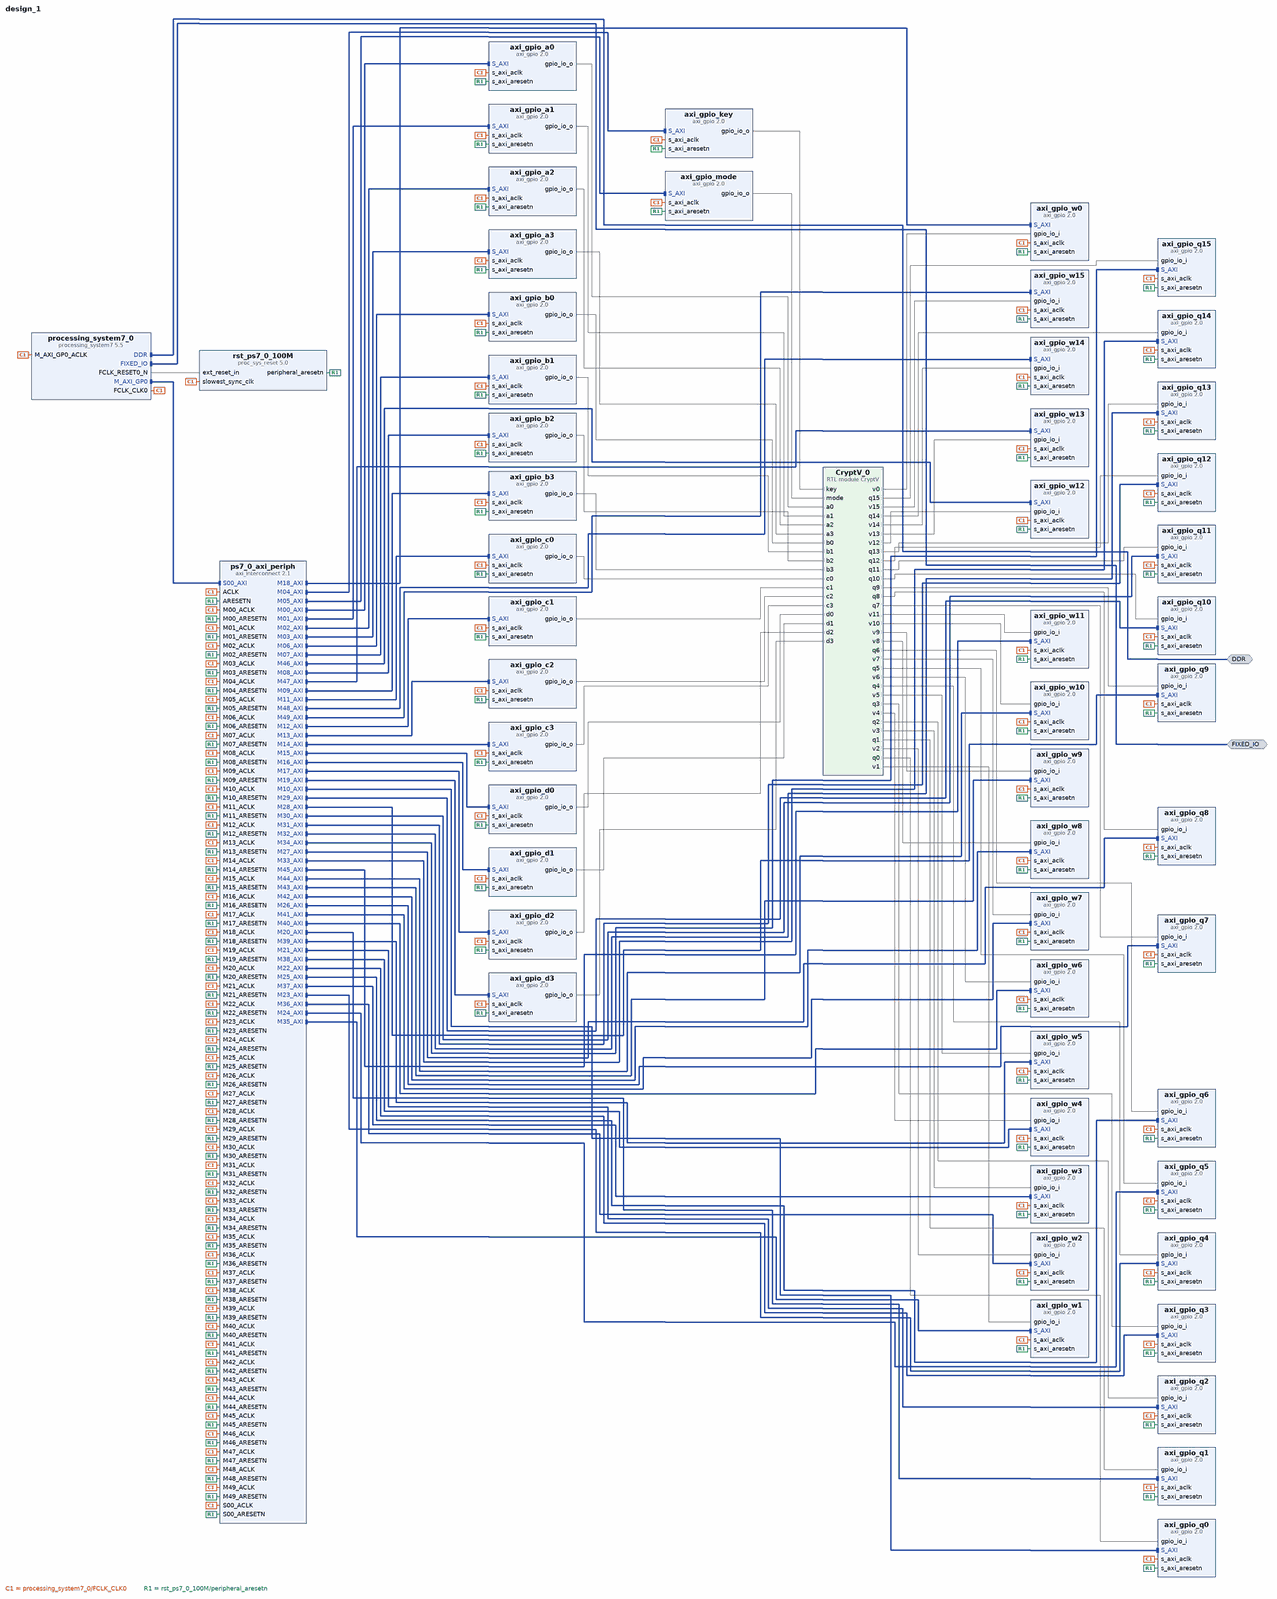
[diagram p0: block diagram of the top level, whole]
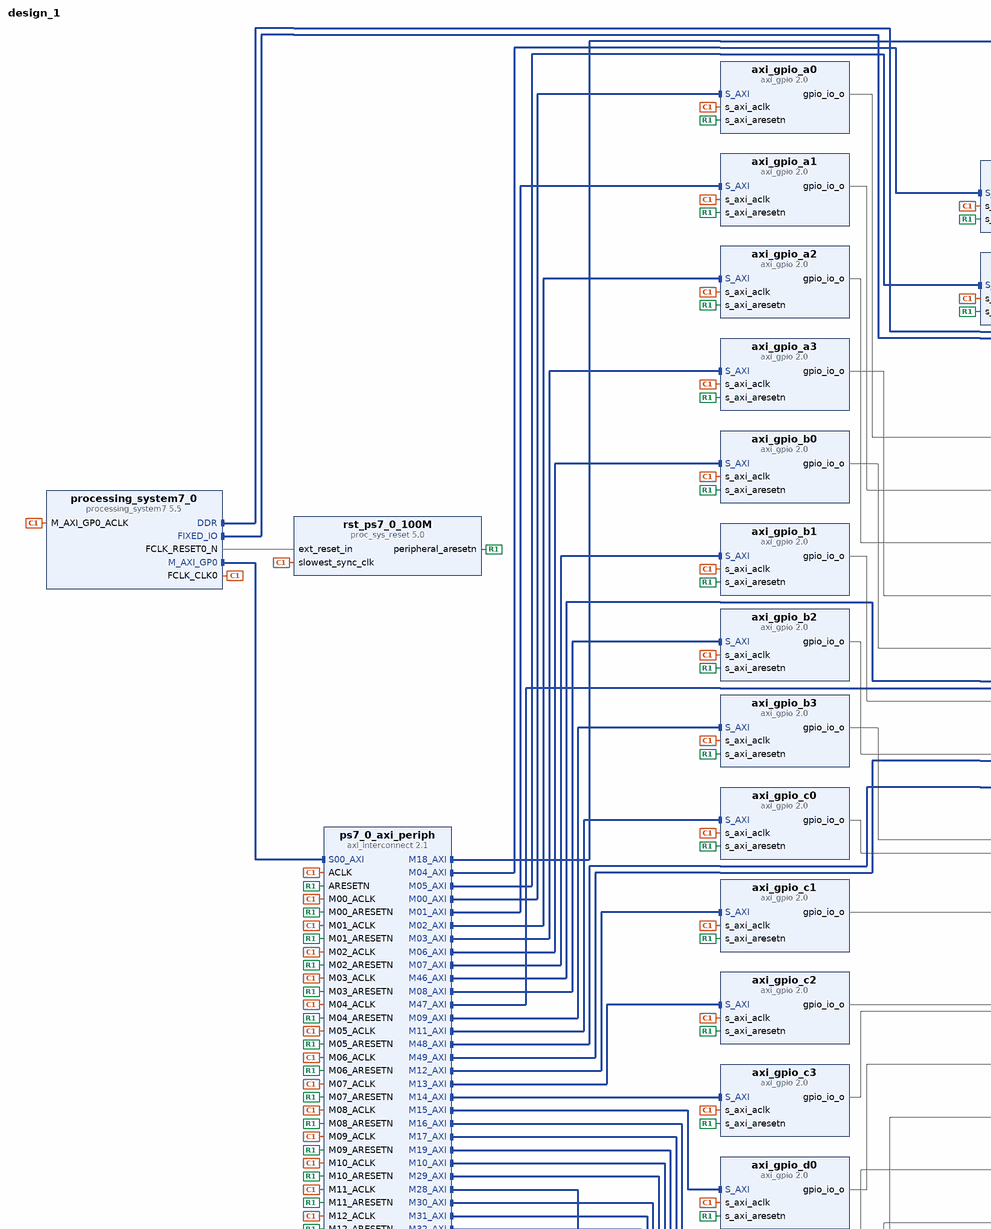
[diagram p1: block diagram of the top level, upper left part]
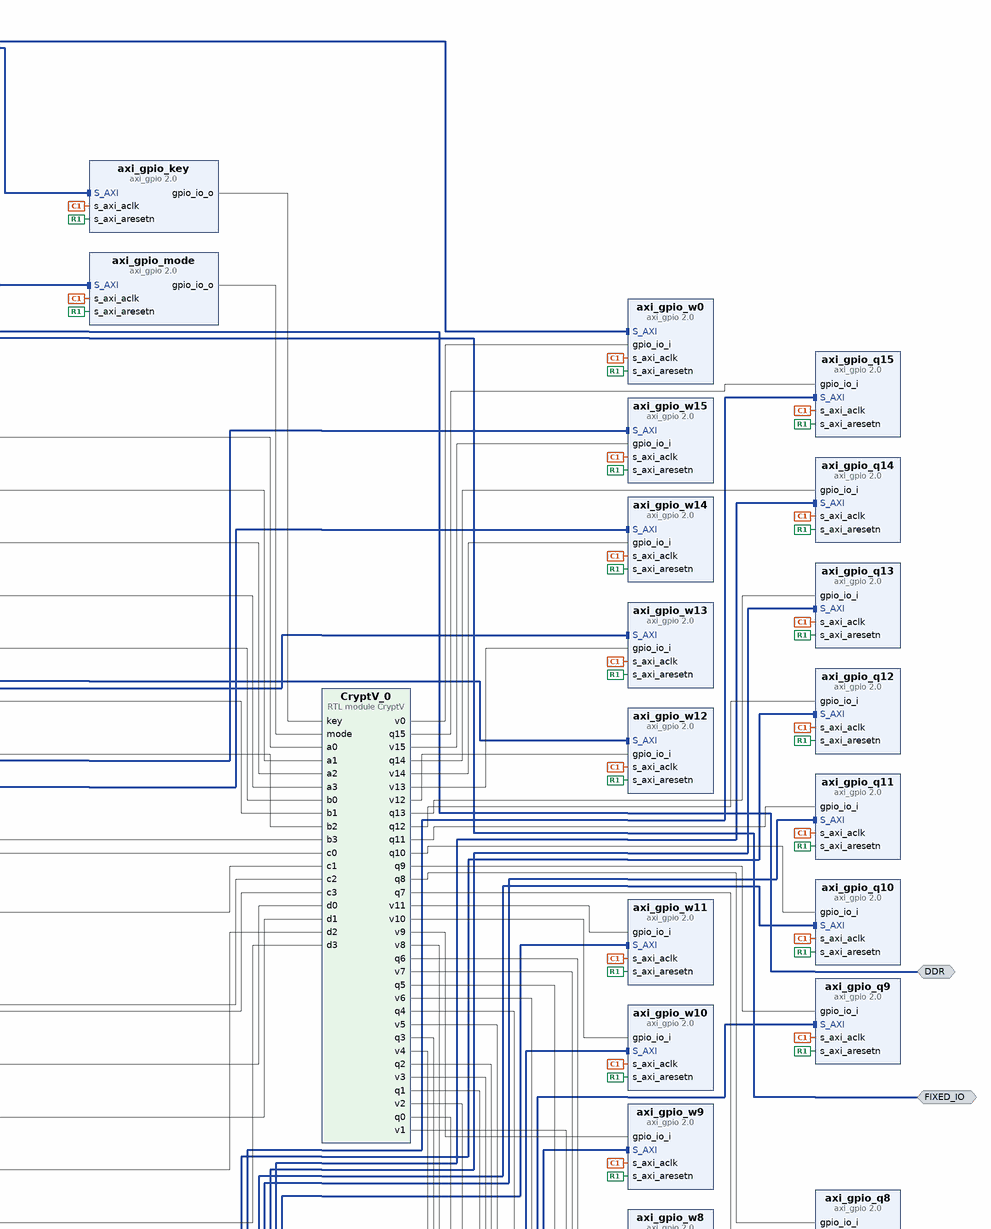
[diagram p2: block diagram of the top level, upper right part]
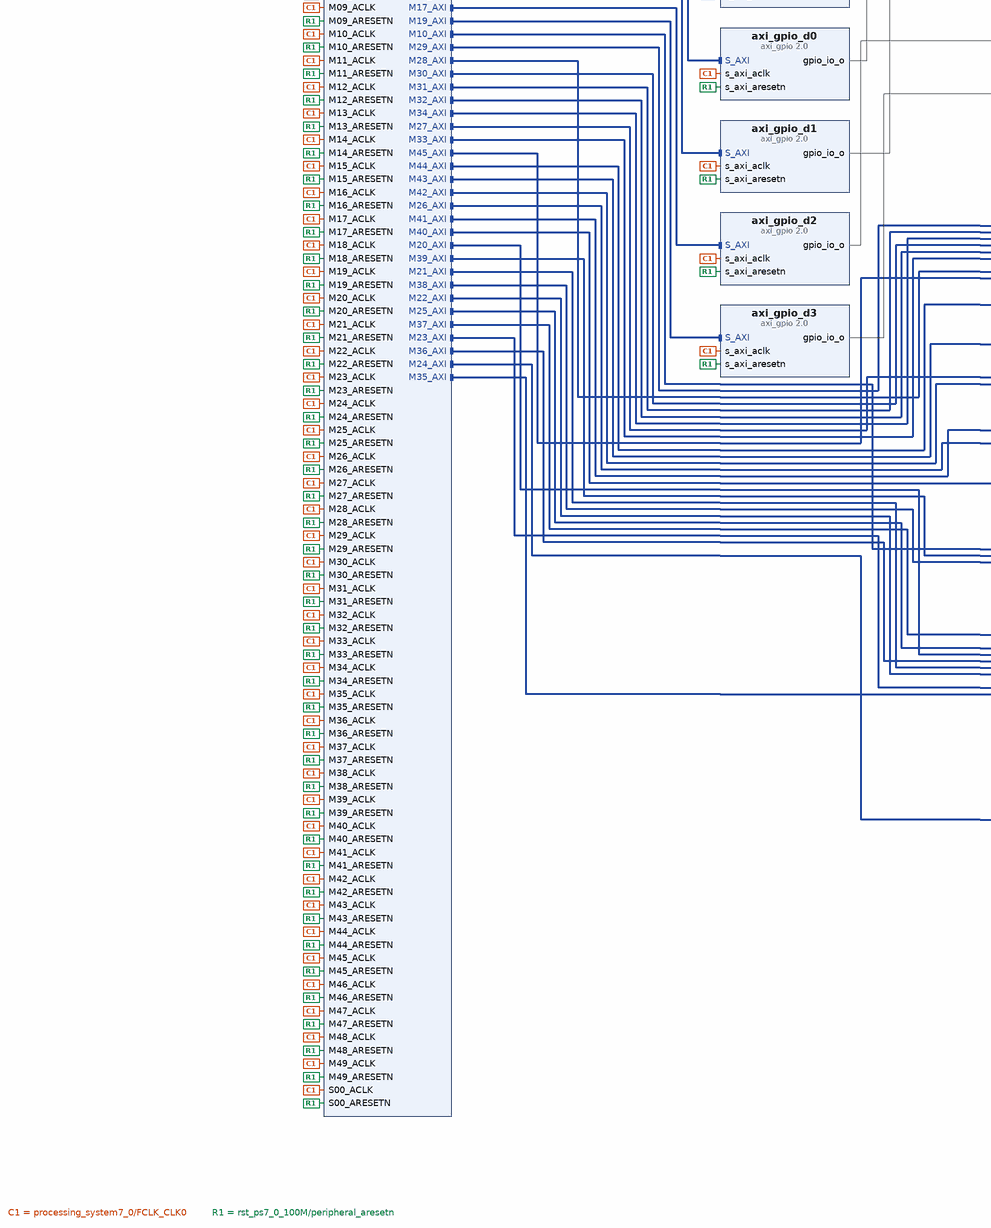
[diagram p3: block diagram of the top level, lower left part]
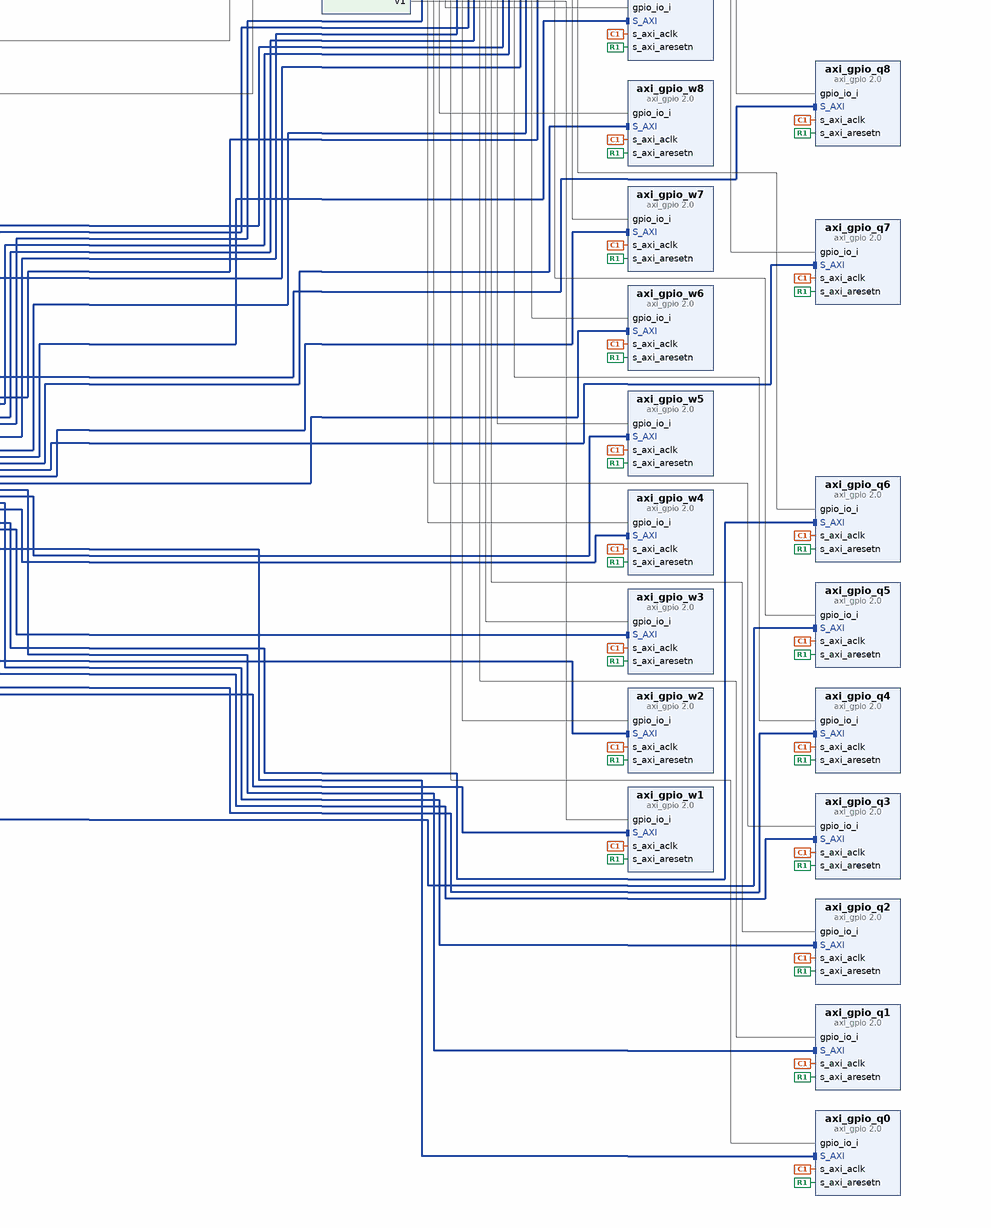
[diagram p4: block diagram of the top level, lower right part]
# Vivado block design design_1, xc7z020clg400-1, Vivado 2022.1
create_bd_design design_1

create_bd_intf_port -mode Master -vlnv xilinx.com:interface:ddrx_rtl:1.0 DDR
create_bd_intf_port -mode Master -vlnv xilinx.com:display_processing_system7:fixedio_rtl:1.0 FIXED_IO

create_bd_cell -type ip -vlnv xilinx.com:ip:processing_system7:5.5 processing_system7_0
set_property -dict [list \
  CONFIG.PCW_APU_PERIPHERAL_FREQMHZ 650 \
  CONFIG.PCW_CRYSTAL_PERIPHERAL_FREQMHZ 50 \
  CONFIG.PCW_ENET0_ENET0_IO {MIO 16 .. 27} \
  CONFIG.PCW_ENET0_GRP_MDIO_ENABLE 1 \
  CONFIG.PCW_ENET0_GRP_MDIO_IO {MIO 52 .. 53} \
  CONFIG.PCW_ENET0_PERIPHERAL_ENABLE 1 \
  CONFIG.PCW_ENET0_RESET_ENABLE 1 \
  CONFIG.PCW_ENET0_RESET_IO {MIO 9} \
  CONFIG.PCW_ENET_RESET_ENABLE 1 \
  CONFIG.PCW_ENET_RESET_SELECT {Share reset pin} \
  CONFIG.PCW_FPGA0_PERIPHERAL_FREQMHZ 100 \
  CONFIG.PCW_FPGA1_PERIPHERAL_FREQMHZ 50 \
  CONFIG.PCW_GPIO_MIO_GPIO_ENABLE 1 \
  CONFIG.PCW_GPIO_MIO_GPIO_IO MIO \
  CONFIG.PCW_I2C_RESET_ENABLE 1 \
  CONFIG.PCW_M_AXI_GP0_FREQMHZ 10 \
  CONFIG.PCW_PERIPHERAL_BOARD_PRESET None \
  CONFIG.PCW_PRESET_BANK1_VOLTAGE {LVCMOS 1.8V} \
  CONFIG.PCW_QSPI_GRP_FBCLK_ENABLE 1 \
  CONFIG.PCW_QSPI_GRP_FBCLK_IO {MIO 8} \
  CONFIG.PCW_QSPI_GRP_SINGLE_SS_ENABLE 1 \
  CONFIG.PCW_QSPI_GRP_SINGLE_SS_IO {MIO 1 .. 6} \
  CONFIG.PCW_QSPI_PERIPHERAL_ENABLE 1 \
  CONFIG.PCW_QSPI_QSPI_IO {MIO 1 .. 6} \
  CONFIG.PCW_SD0_GRP_CD_ENABLE 1 \
  CONFIG.PCW_SD0_GRP_CD_IO {MIO 47} \
  CONFIG.PCW_SD0_GRP_WP_ENABLE 0 \
  CONFIG.PCW_SD0_PERIPHERAL_ENABLE 1 \
  CONFIG.PCW_SD0_SD0_IO {MIO 40 .. 45} \
  CONFIG.PCW_SDIO_PERIPHERAL_FREQMHZ 50 \
  CONFIG.PCW_SINGLE_QSPI_DATA_MODE x4 \
  CONFIG.PCW_UART0_PERIPHERAL_ENABLE 1 \
  CONFIG.PCW_UART0_UART0_IO {MIO 14 .. 15} \
  CONFIG.PCW_UART1_PERIPHERAL_ENABLE 0 \
  CONFIG.PCW_UART_PERIPHERAL_FREQMHZ 100 \
  CONFIG.PCW_UIPARAM_DDR_BUS_WIDTH {16 Bit} \
  CONFIG.PCW_UIPARAM_DDR_FREQ_MHZ 525 \
  CONFIG.PCW_UIPARAM_DDR_PARTNO {MT41J256M16 RE-125} \
  CONFIG.PCW_USB0_PERIPHERAL_ENABLE 1 \
  CONFIG.PCW_USB0_RESET_ENABLE 1 \
  CONFIG.PCW_USB0_RESET_IO {MIO 46} \
  CONFIG.PCW_USB0_USB0_IO {MIO 28 .. 39} \
  CONFIG.PCW_USB_RESET_ENABLE 1 \
  CONFIG.PCW_USB_RESET_SELECT {Share reset pin} \
] [get_bd_cells processing_system7_0]
# 481 more settings of processing_system7_0 are not shown: defaults, MIO pin electricals, DDR timing, and values the tool derives
create_bd_cell -type ip -vlnv xilinx.com:ip:axi_gpio:2.0 axi_gpio_key
set_property -dict {CONFIG.C_ALL_OUTPUTS 1 CONFIG.C_GPIO_WIDTH 10} [get_bd_cells axi_gpio_key]
create_bd_cell -type ip -vlnv xilinx.com:ip:axi_gpio:2.0 axi_gpio_mode
set_property -dict {CONFIG.C_ALL_OUTPUTS 1 CONFIG.C_GPIO_WIDTH 1} [get_bd_cells axi_gpio_mode]
create_bd_cell -type ip -vlnv xilinx.com:ip:axi_gpio:2.0 axi_gpio_q0
set_property -dict {CONFIG.C_ALL_INPUTS 1 CONFIG.C_GPIO_WIDTH 8 CONFIG.C_IS_DUAL 0} [get_bd_cells axi_gpio_q0]
create_bd_cell -type ip -vlnv xilinx.com:ip:axi_gpio:2.0 axi_gpio_w0
set_property -dict {CONFIG.C_ALL_INPUTS 1 CONFIG.C_GPIO_WIDTH 8 CONFIG.C_IS_DUAL 0} [get_bd_cells axi_gpio_w0]
create_bd_cell -type ip -vlnv xilinx.com:ip:axi_interconnect:2.1 ps7_0_axi_periph
set_property -dict {CONFIG.NUM_MI 50} [get_bd_cells ps7_0_axi_periph]
create_bd_cell -type ip -vlnv xilinx.com:ip:proc_sys_reset:5.0 rst_ps7_0_100M
create_bd_cell -type module -reference CryptV CryptV_0
create_bd_cell -type ip -vlnv xilinx.com:ip:axi_gpio:2.0 axi_gpio_a0
set_property -dict {CONFIG.C_ALL_OUTPUTS 1 CONFIG.C_GPIO_WIDTH 8 CONFIG.C_IS_DUAL 0} [get_bd_cells axi_gpio_a0]
create_bd_cell -type ip -vlnv xilinx.com:ip:axi_gpio:2.0 axi_gpio_q1
set_property -dict {CONFIG.C_ALL_INPUTS 1 CONFIG.C_GPIO_WIDTH 8 CONFIG.C_IS_DUAL 0} [get_bd_cells axi_gpio_q1]
create_bd_cell -type ip -vlnv xilinx.com:ip:axi_gpio:2.0 axi_gpio_q2
set_property -dict {CONFIG.C_ALL_INPUTS 1 CONFIG.C_GPIO_WIDTH 8 CONFIG.C_IS_DUAL 0} [get_bd_cells axi_gpio_q2]
create_bd_cell -type ip -vlnv xilinx.com:ip:axi_gpio:2.0 axi_gpio_q3
set_property -dict {CONFIG.C_ALL_INPUTS 1 CONFIG.C_GPIO_WIDTH 8 CONFIG.C_IS_DUAL 0} [get_bd_cells axi_gpio_q3]
create_bd_cell -type ip -vlnv xilinx.com:ip:axi_gpio:2.0 axi_gpio_q4
set_property -dict {CONFIG.C_ALL_INPUTS 1 CONFIG.C_GPIO_WIDTH 8 CONFIG.C_IS_DUAL 0} [get_bd_cells axi_gpio_q4]
create_bd_cell -type ip -vlnv xilinx.com:ip:axi_gpio:2.0 axi_gpio_q5
set_property -dict {CONFIG.C_ALL_INPUTS 1 CONFIG.C_GPIO_WIDTH 8 CONFIG.C_IS_DUAL 0} [get_bd_cells axi_gpio_q5]
create_bd_cell -type ip -vlnv xilinx.com:ip:axi_gpio:2.0 axi_gpio_q6
set_property -dict {CONFIG.C_ALL_INPUTS 1 CONFIG.C_GPIO_WIDTH 8 CONFIG.C_IS_DUAL 0} [get_bd_cells axi_gpio_q6]
create_bd_cell -type ip -vlnv xilinx.com:ip:axi_gpio:2.0 axi_gpio_q7
set_property -dict {CONFIG.C_ALL_INPUTS 1 CONFIG.C_GPIO_WIDTH 8 CONFIG.C_IS_DUAL 0} [get_bd_cells axi_gpio_q7]
create_bd_cell -type ip -vlnv xilinx.com:ip:axi_gpio:2.0 axi_gpio_q8
set_property -dict {CONFIG.C_ALL_INPUTS 1 CONFIG.C_GPIO_WIDTH 8 CONFIG.C_IS_DUAL 0} [get_bd_cells axi_gpio_q8]
create_bd_cell -type ip -vlnv xilinx.com:ip:axi_gpio:2.0 axi_gpio_q9
set_property -dict {CONFIG.C_ALL_INPUTS 1 CONFIG.C_GPIO_WIDTH 8 CONFIG.C_IS_DUAL 0} [get_bd_cells axi_gpio_q9]
create_bd_cell -type ip -vlnv xilinx.com:ip:axi_gpio:2.0 axi_gpio_q10
set_property -dict {CONFIG.C_ALL_INPUTS 1 CONFIG.C_GPIO_WIDTH 8 CONFIG.C_IS_DUAL 0} [get_bd_cells axi_gpio_q10]
create_bd_cell -type ip -vlnv xilinx.com:ip:axi_gpio:2.0 axi_gpio_q11
set_property -dict {CONFIG.C_ALL_INPUTS 1 CONFIG.C_GPIO_WIDTH 8 CONFIG.C_IS_DUAL 0} [get_bd_cells axi_gpio_q11]
create_bd_cell -type ip -vlnv xilinx.com:ip:axi_gpio:2.0 axi_gpio_q12
set_property -dict {CONFIG.C_ALL_INPUTS 1 CONFIG.C_GPIO_WIDTH 8 CONFIG.C_IS_DUAL 0} [get_bd_cells axi_gpio_q12]
create_bd_cell -type ip -vlnv xilinx.com:ip:axi_gpio:2.0 axi_gpio_q13
set_property -dict {CONFIG.C_ALL_INPUTS 1 CONFIG.C_GPIO_WIDTH 8 CONFIG.C_IS_DUAL 0} [get_bd_cells axi_gpio_q13]
create_bd_cell -type ip -vlnv xilinx.com:ip:axi_gpio:2.0 axi_gpio_q14
set_property -dict {CONFIG.C_ALL_INPUTS 1 CONFIG.C_GPIO_WIDTH 8 CONFIG.C_IS_DUAL 0} [get_bd_cells axi_gpio_q14]
create_bd_cell -type ip -vlnv xilinx.com:ip:axi_gpio:2.0 axi_gpio_q15
set_property -dict {CONFIG.C_ALL_INPUTS 1 CONFIG.C_GPIO_WIDTH 8 CONFIG.C_IS_DUAL 0} [get_bd_cells axi_gpio_q15]
create_bd_cell -type ip -vlnv xilinx.com:ip:axi_gpio:2.0 axi_gpio_w1
set_property -dict {CONFIG.C_ALL_INPUTS 1 CONFIG.C_GPIO_WIDTH 8 CONFIG.C_IS_DUAL 0} [get_bd_cells axi_gpio_w1]
create_bd_cell -type ip -vlnv xilinx.com:ip:axi_gpio:2.0 axi_gpio_w2
set_property -dict {CONFIG.C_ALL_INPUTS 1 CONFIG.C_GPIO_WIDTH 8 CONFIG.C_IS_DUAL 0} [get_bd_cells axi_gpio_w2]
create_bd_cell -type ip -vlnv xilinx.com:ip:axi_gpio:2.0 axi_gpio_w3
set_property -dict {CONFIG.C_ALL_INPUTS 1 CONFIG.C_GPIO_WIDTH 8 CONFIG.C_IS_DUAL 0} [get_bd_cells axi_gpio_w3]
create_bd_cell -type ip -vlnv xilinx.com:ip:axi_gpio:2.0 axi_gpio_w4
set_property -dict {CONFIG.C_ALL_INPUTS 1 CONFIG.C_GPIO_WIDTH 8 CONFIG.C_IS_DUAL 0} [get_bd_cells axi_gpio_w4]
create_bd_cell -type ip -vlnv xilinx.com:ip:axi_gpio:2.0 axi_gpio_w5
set_property -dict {CONFIG.C_ALL_INPUTS 1 CONFIG.C_GPIO_WIDTH 8 CONFIG.C_IS_DUAL 0} [get_bd_cells axi_gpio_w5]
create_bd_cell -type ip -vlnv xilinx.com:ip:axi_gpio:2.0 axi_gpio_w6
set_property -dict {CONFIG.C_ALL_INPUTS 1 CONFIG.C_GPIO_WIDTH 8 CONFIG.C_IS_DUAL 0} [get_bd_cells axi_gpio_w6]
create_bd_cell -type ip -vlnv xilinx.com:ip:axi_gpio:2.0 axi_gpio_w7
set_property -dict {CONFIG.C_ALL_INPUTS 1 CONFIG.C_GPIO_WIDTH 8 CONFIG.C_IS_DUAL 0} [get_bd_cells axi_gpio_w7]
create_bd_cell -type ip -vlnv xilinx.com:ip:axi_gpio:2.0 axi_gpio_w8
set_property -dict {CONFIG.C_ALL_INPUTS 1 CONFIG.C_GPIO_WIDTH 8 CONFIG.C_IS_DUAL 0} [get_bd_cells axi_gpio_w8]
create_bd_cell -type ip -vlnv xilinx.com:ip:axi_gpio:2.0 axi_gpio_w9
set_property -dict {CONFIG.C_ALL_INPUTS 1 CONFIG.C_GPIO_WIDTH 8 CONFIG.C_IS_DUAL 0} [get_bd_cells axi_gpio_w9]
create_bd_cell -type ip -vlnv xilinx.com:ip:axi_gpio:2.0 axi_gpio_w10
set_property -dict {CONFIG.C_ALL_INPUTS 1 CONFIG.C_GPIO_WIDTH 8 CONFIG.C_IS_DUAL 0} [get_bd_cells axi_gpio_w10]
create_bd_cell -type ip -vlnv xilinx.com:ip:axi_gpio:2.0 axi_gpio_w11
set_property -dict {CONFIG.C_ALL_INPUTS 1 CONFIG.C_GPIO_WIDTH 8 CONFIG.C_IS_DUAL 0} [get_bd_cells axi_gpio_w11]
create_bd_cell -type ip -vlnv xilinx.com:ip:axi_gpio:2.0 axi_gpio_w12
set_property -dict {CONFIG.C_ALL_INPUTS 1 CONFIG.C_GPIO_WIDTH 8 CONFIG.C_IS_DUAL 0} [get_bd_cells axi_gpio_w12]
create_bd_cell -type ip -vlnv xilinx.com:ip:axi_gpio:2.0 axi_gpio_w13
set_property -dict {CONFIG.C_ALL_INPUTS 1 CONFIG.C_GPIO_WIDTH 8 CONFIG.C_IS_DUAL 0} [get_bd_cells axi_gpio_w13]
create_bd_cell -type ip -vlnv xilinx.com:ip:axi_gpio:2.0 axi_gpio_w14
set_property -dict {CONFIG.C_ALL_INPUTS 1 CONFIG.C_GPIO_WIDTH 8 CONFIG.C_IS_DUAL 0} [get_bd_cells axi_gpio_w14]
create_bd_cell -type ip -vlnv xilinx.com:ip:axi_gpio:2.0 axi_gpio_w15
set_property -dict {CONFIG.C_ALL_INPUTS 1 CONFIG.C_GPIO_WIDTH 8 CONFIG.C_IS_DUAL 0} [get_bd_cells axi_gpio_w15]
create_bd_cell -type ip -vlnv xilinx.com:ip:axi_gpio:2.0 axi_gpio_a1
set_property -dict {CONFIG.C_ALL_OUTPUTS 1 CONFIG.C_GPIO_WIDTH 8 CONFIG.C_IS_DUAL 0} [get_bd_cells axi_gpio_a1]
create_bd_cell -type ip -vlnv xilinx.com:ip:axi_gpio:2.0 axi_gpio_a2
set_property -dict {CONFIG.C_ALL_OUTPUTS 1 CONFIG.C_GPIO_WIDTH 8 CONFIG.C_IS_DUAL 0} [get_bd_cells axi_gpio_a2]
create_bd_cell -type ip -vlnv xilinx.com:ip:axi_gpio:2.0 axi_gpio_a3
set_property -dict {CONFIG.C_ALL_OUTPUTS 1 CONFIG.C_GPIO_WIDTH 8 CONFIG.C_IS_DUAL 0} [get_bd_cells axi_gpio_a3]
create_bd_cell -type ip -vlnv xilinx.com:ip:axi_gpio:2.0 axi_gpio_b0
set_property -dict {CONFIG.C_ALL_OUTPUTS 1 CONFIG.C_GPIO_WIDTH 8 CONFIG.C_IS_DUAL 0} [get_bd_cells axi_gpio_b0]
create_bd_cell -type ip -vlnv xilinx.com:ip:axi_gpio:2.0 axi_gpio_c0
set_property -dict {CONFIG.C_ALL_OUTPUTS 1 CONFIG.C_GPIO_WIDTH 8 CONFIG.C_IS_DUAL 0} [get_bd_cells axi_gpio_c0]
create_bd_cell -type ip -vlnv xilinx.com:ip:axi_gpio:2.0 axi_gpio_d0
set_property -dict {CONFIG.C_ALL_OUTPUTS 1 CONFIG.C_GPIO_WIDTH 8 CONFIG.C_IS_DUAL 0} [get_bd_cells axi_gpio_d0]
create_bd_cell -type ip -vlnv xilinx.com:ip:axi_gpio:2.0 axi_gpio_b1
set_property -dict {CONFIG.C_ALL_OUTPUTS 1 CONFIG.C_GPIO_WIDTH 8 CONFIG.C_IS_DUAL 0} [get_bd_cells axi_gpio_b1]
create_bd_cell -type ip -vlnv xilinx.com:ip:axi_gpio:2.0 axi_gpio_b2
set_property -dict {CONFIG.C_ALL_OUTPUTS 1 CONFIG.C_GPIO_WIDTH 8 CONFIG.C_IS_DUAL 0} [get_bd_cells axi_gpio_b2]
create_bd_cell -type ip -vlnv xilinx.com:ip:axi_gpio:2.0 axi_gpio_b3
set_property -dict {CONFIG.C_ALL_OUTPUTS 1 CONFIG.C_GPIO_WIDTH 8 CONFIG.C_IS_DUAL 0} [get_bd_cells axi_gpio_b3]
create_bd_cell -type ip -vlnv xilinx.com:ip:axi_gpio:2.0 axi_gpio_c1
set_property -dict {CONFIG.C_ALL_OUTPUTS 1 CONFIG.C_GPIO_WIDTH 8 CONFIG.C_IS_DUAL 0} [get_bd_cells axi_gpio_c1]
create_bd_cell -type ip -vlnv xilinx.com:ip:axi_gpio:2.0 axi_gpio_c2
set_property -dict {CONFIG.C_ALL_OUTPUTS 1 CONFIG.C_GPIO_WIDTH 8 CONFIG.C_IS_DUAL 0} [get_bd_cells axi_gpio_c2]
create_bd_cell -type ip -vlnv xilinx.com:ip:axi_gpio:2.0 axi_gpio_c3
set_property -dict {CONFIG.C_ALL_OUTPUTS 1 CONFIG.C_GPIO_WIDTH 8 CONFIG.C_IS_DUAL 0} [get_bd_cells axi_gpio_c3]
create_bd_cell -type ip -vlnv xilinx.com:ip:axi_gpio:2.0 axi_gpio_d1
set_property -dict {CONFIG.C_ALL_OUTPUTS 1 CONFIG.C_GPIO_WIDTH 8 CONFIG.C_IS_DUAL 0} [get_bd_cells axi_gpio_d1]
create_bd_cell -type ip -vlnv xilinx.com:ip:axi_gpio:2.0 axi_gpio_d2
set_property -dict {CONFIG.C_ALL_OUTPUTS 1 CONFIG.C_GPIO_WIDTH 8 CONFIG.C_IS_DUAL 0} [get_bd_cells axi_gpio_d2]
create_bd_cell -type ip -vlnv xilinx.com:ip:axi_gpio:2.0 axi_gpio_d3
set_property -dict {CONFIG.C_ALL_OUTPUTS 1 CONFIG.C_GPIO_WIDTH 8 CONFIG.C_IS_DUAL 0} [get_bd_cells axi_gpio_d3]

# ---- connections ----

connect_bd_intf_net [get_bd_intf_ports DDR] [get_bd_intf_pins processing_system7_0/DDR]
connect_bd_intf_net [get_bd_intf_ports FIXED_IO] [get_bd_intf_pins processing_system7_0/FIXED_IO]
connect_bd_intf_net [get_bd_intf_pins processing_system7_0/M_AXI_GP0] [get_bd_intf_pins ps7_0_axi_periph/S00_AXI]
connect_bd_intf_net [get_bd_intf_pins ps7_0_axi_periph/M00_AXI] [get_bd_intf_pins axi_gpio_a0/S_AXI]
connect_bd_intf_net [get_bd_intf_pins ps7_0_axi_periph/M01_AXI] [get_bd_intf_pins axi_gpio_a1/S_AXI]
connect_bd_intf_net [get_bd_intf_pins ps7_0_axi_periph/M02_AXI] [get_bd_intf_pins axi_gpio_a2/S_AXI]
connect_bd_intf_net [get_bd_intf_pins ps7_0_axi_periph/M03_AXI] [get_bd_intf_pins axi_gpio_a3/S_AXI]
connect_bd_intf_net [get_bd_intf_pins ps7_0_axi_periph/M04_AXI] [get_bd_intf_pins axi_gpio_key/S_AXI]
connect_bd_intf_net [get_bd_intf_pins ps7_0_axi_periph/M05_AXI] [get_bd_intf_pins axi_gpio_mode/S_AXI]
connect_bd_intf_net [get_bd_intf_pins ps7_0_axi_periph/M06_AXI] [get_bd_intf_pins axi_gpio_b0/S_AXI]
connect_bd_intf_net [get_bd_intf_pins ps7_0_axi_periph/M07_AXI] [get_bd_intf_pins axi_gpio_b1/S_AXI]
connect_bd_intf_net [get_bd_intf_pins ps7_0_axi_periph/M08_AXI] [get_bd_intf_pins axi_gpio_b2/S_AXI]
connect_bd_intf_net [get_bd_intf_pins ps7_0_axi_periph/M09_AXI] [get_bd_intf_pins axi_gpio_b3/S_AXI]
connect_bd_intf_net [get_bd_intf_pins ps7_0_axi_periph/M10_AXI] [get_bd_intf_pins axi_gpio_q0/S_AXI]
connect_bd_intf_net [get_bd_intf_pins ps7_0_axi_periph/M11_AXI] [get_bd_intf_pins axi_gpio_c0/S_AXI]
connect_bd_intf_net [get_bd_intf_pins ps7_0_axi_periph/M12_AXI] [get_bd_intf_pins axi_gpio_c1/S_AXI]
connect_bd_intf_net [get_bd_intf_pins ps7_0_axi_periph/M13_AXI] [get_bd_intf_pins axi_gpio_c2/S_AXI]
connect_bd_intf_net [get_bd_intf_pins ps7_0_axi_periph/M14_AXI] [get_bd_intf_pins axi_gpio_c3/S_AXI]
connect_bd_intf_net [get_bd_intf_pins ps7_0_axi_periph/M15_AXI] [get_bd_intf_pins axi_gpio_d0/S_AXI]
connect_bd_intf_net [get_bd_intf_pins ps7_0_axi_periph/M16_AXI] [get_bd_intf_pins axi_gpio_d1/S_AXI]
connect_bd_intf_net [get_bd_intf_pins ps7_0_axi_periph/M17_AXI] [get_bd_intf_pins axi_gpio_d2/S_AXI]
connect_bd_intf_net [get_bd_intf_pins ps7_0_axi_periph/M18_AXI] [get_bd_intf_pins axi_gpio_w0/S_AXI]
connect_bd_intf_net [get_bd_intf_pins ps7_0_axi_periph/M19_AXI] [get_bd_intf_pins axi_gpio_d3/S_AXI]
connect_bd_intf_net [get_bd_intf_pins ps7_0_axi_periph/M20_AXI] [get_bd_intf_pins axi_gpio_q1/S_AXI]
connect_bd_intf_net [get_bd_intf_pins ps7_0_axi_periph/M21_AXI] [get_bd_intf_pins axi_gpio_q2/S_AXI]
connect_bd_intf_net [get_bd_intf_pins ps7_0_axi_periph/M22_AXI] [get_bd_intf_pins axi_gpio_q3/S_AXI]
connect_bd_intf_net [get_bd_intf_pins ps7_0_axi_periph/M23_AXI] [get_bd_intf_pins axi_gpio_q4/S_AXI]
connect_bd_intf_net [get_bd_intf_pins ps7_0_axi_periph/M24_AXI] [get_bd_intf_pins axi_gpio_q5/S_AXI]
connect_bd_intf_net [get_bd_intf_pins ps7_0_axi_periph/M25_AXI] [get_bd_intf_pins axi_gpio_q6/S_AXI]
connect_bd_intf_net [get_bd_intf_pins ps7_0_axi_periph/M26_AXI] [get_bd_intf_pins axi_gpio_q7/S_AXI]
connect_bd_intf_net [get_bd_intf_pins ps7_0_axi_periph/M27_AXI] [get_bd_intf_pins axi_gpio_q8/S_AXI]
connect_bd_intf_net [get_bd_intf_pins ps7_0_axi_periph/M28_AXI] [get_bd_intf_pins axi_gpio_q9/S_AXI]
connect_bd_intf_net [get_bd_intf_pins ps7_0_axi_periph/M29_AXI] [get_bd_intf_pins axi_gpio_q10/S_AXI]
connect_bd_intf_net [get_bd_intf_pins ps7_0_axi_periph/M30_AXI] [get_bd_intf_pins axi_gpio_q11/S_AXI]
connect_bd_intf_net [get_bd_intf_pins ps7_0_axi_periph/M31_AXI] [get_bd_intf_pins axi_gpio_q12/S_AXI]
connect_bd_intf_net [get_bd_intf_pins ps7_0_axi_periph/M32_AXI] [get_bd_intf_pins axi_gpio_q13/S_AXI]
connect_bd_intf_net [get_bd_intf_pins ps7_0_axi_periph/M33_AXI] [get_bd_intf_pins axi_gpio_q14/S_AXI]
connect_bd_intf_net [get_bd_intf_pins ps7_0_axi_periph/M34_AXI] [get_bd_intf_pins axi_gpio_q15/S_AXI]
connect_bd_intf_net [get_bd_intf_pins ps7_0_axi_periph/M35_AXI] [get_bd_intf_pins axi_gpio_w1/S_AXI]
connect_bd_intf_net [get_bd_intf_pins ps7_0_axi_periph/M36_AXI] [get_bd_intf_pins axi_gpio_w2/S_AXI]
connect_bd_intf_net [get_bd_intf_pins ps7_0_axi_periph/M37_AXI] [get_bd_intf_pins axi_gpio_w3/S_AXI]
connect_bd_intf_net [get_bd_intf_pins ps7_0_axi_periph/M38_AXI] [get_bd_intf_pins axi_gpio_w4/S_AXI]
connect_bd_intf_net [get_bd_intf_pins ps7_0_axi_periph/M39_AXI] [get_bd_intf_pins axi_gpio_w5/S_AXI]
connect_bd_intf_net [get_bd_intf_pins ps7_0_axi_periph/M40_AXI] [get_bd_intf_pins axi_gpio_w6/S_AXI]
connect_bd_intf_net [get_bd_intf_pins ps7_0_axi_periph/M41_AXI] [get_bd_intf_pins axi_gpio_w7/S_AXI]
connect_bd_intf_net [get_bd_intf_pins ps7_0_axi_periph/M42_AXI] [get_bd_intf_pins axi_gpio_w8/S_AXI]
connect_bd_intf_net [get_bd_intf_pins ps7_0_axi_periph/M43_AXI] [get_bd_intf_pins axi_gpio_w9/S_AXI]
connect_bd_intf_net [get_bd_intf_pins ps7_0_axi_periph/M44_AXI] [get_bd_intf_pins axi_gpio_w10/S_AXI]
connect_bd_intf_net [get_bd_intf_pins ps7_0_axi_periph/M45_AXI] [get_bd_intf_pins axi_gpio_w11/S_AXI]
connect_bd_intf_net [get_bd_intf_pins ps7_0_axi_periph/M46_AXI] [get_bd_intf_pins axi_gpio_w12/S_AXI]
connect_bd_intf_net [get_bd_intf_pins ps7_0_axi_periph/M47_AXI] [get_bd_intf_pins axi_gpio_w13/S_AXI]
connect_bd_intf_net [get_bd_intf_pins ps7_0_axi_periph/M48_AXI] [get_bd_intf_pins axi_gpio_w14/S_AXI]
connect_bd_intf_net [get_bd_intf_pins ps7_0_axi_periph/M49_AXI] [get_bd_intf_pins axi_gpio_w15/S_AXI]
connect_bd_net [get_bd_pins CryptV_0/q0] [get_bd_pins axi_gpio_q0/gpio_io_i]
connect_bd_net [get_bd_pins CryptV_0/q1] [get_bd_pins axi_gpio_q1/gpio_io_i]
connect_bd_net [get_bd_pins CryptV_0/q2] [get_bd_pins axi_gpio_q2/gpio_io_i]
connect_bd_net [get_bd_pins CryptV_0/q3] [get_bd_pins axi_gpio_q3/gpio_io_i]
connect_bd_net [get_bd_pins CryptV_0/q4] [get_bd_pins axi_gpio_q4/gpio_io_i]
connect_bd_net [get_bd_pins CryptV_0/q5] [get_bd_pins axi_gpio_q5/gpio_io_i]
connect_bd_net [get_bd_pins CryptV_0/q6] [get_bd_pins axi_gpio_q6/gpio_io_i]
connect_bd_net [get_bd_pins CryptV_0/q7] [get_bd_pins axi_gpio_q7/gpio_io_i]
connect_bd_net [get_bd_pins CryptV_0/q8] [get_bd_pins axi_gpio_q8/gpio_io_i]
connect_bd_net [get_bd_pins CryptV_0/q9] [get_bd_pins axi_gpio_q9/gpio_io_i]
connect_bd_net [get_bd_pins CryptV_0/q10] [get_bd_pins axi_gpio_q10/gpio_io_i]
connect_bd_net [get_bd_pins CryptV_0/q11] [get_bd_pins axi_gpio_q11/gpio_io_i]
connect_bd_net [get_bd_pins CryptV_0/q12] [get_bd_pins axi_gpio_q12/gpio_io_i]
connect_bd_net [get_bd_pins CryptV_0/q13] [get_bd_pins axi_gpio_q13/gpio_io_i]
connect_bd_net [get_bd_pins CryptV_0/q14] [get_bd_pins axi_gpio_q14/gpio_io_i]
connect_bd_net [get_bd_pins CryptV_0/q15] [get_bd_pins axi_gpio_q15/gpio_io_i]
connect_bd_net [get_bd_pins CryptV_0/v0] [get_bd_pins axi_gpio_w0/gpio_io_i]
connect_bd_net [get_bd_pins CryptV_0/v1] [get_bd_pins axi_gpio_w1/gpio_io_i]
connect_bd_net [get_bd_pins CryptV_0/v2] [get_bd_pins axi_gpio_w2/gpio_io_i]
connect_bd_net [get_bd_pins CryptV_0/v3] [get_bd_pins axi_gpio_w3/gpio_io_i]
connect_bd_net [get_bd_pins CryptV_0/v4] [get_bd_pins axi_gpio_w4/gpio_io_i]
connect_bd_net [get_bd_pins CryptV_0/v5] [get_bd_pins axi_gpio_w5/gpio_io_i]
connect_bd_net [get_bd_pins CryptV_0/v6] [get_bd_pins axi_gpio_w6/gpio_io_i]
connect_bd_net [get_bd_pins CryptV_0/v7] [get_bd_pins axi_gpio_w7/gpio_io_i]
connect_bd_net [get_bd_pins CryptV_0/v8] [get_bd_pins axi_gpio_w8/gpio_io_i]
connect_bd_net [get_bd_pins CryptV_0/v9] [get_bd_pins axi_gpio_w9/gpio_io_i]
connect_bd_net [get_bd_pins CryptV_0/v10] [get_bd_pins axi_gpio_w10/gpio_io_i]
connect_bd_net [get_bd_pins CryptV_0/v11] [get_bd_pins axi_gpio_w11/gpio_io_i]
connect_bd_net [get_bd_pins CryptV_0/v12] [get_bd_pins axi_gpio_w12/gpio_io_i]
connect_bd_net [get_bd_pins CryptV_0/v13] [get_bd_pins axi_gpio_w13/gpio_io_i]
connect_bd_net [get_bd_pins CryptV_0/v14] [get_bd_pins axi_gpio_w14/gpio_io_i]
connect_bd_net [get_bd_pins CryptV_0/v15] [get_bd_pins axi_gpio_w15/gpio_io_i]
connect_bd_net -net axi_gpio_0_gpio_io_o [get_bd_pins axi_gpio_key/gpio_io_o] [get_bd_pins CryptV_0/key]
connect_bd_net -net axi_gpio_0_gpio_io_o1 [get_bd_pins axi_gpio_mode/gpio_io_o] [get_bd_pins CryptV_0/mode]
connect_bd_net -net axi_gpio_a01_gpio_io_o [get_bd_pins axi_gpio_a0/gpio_io_o] [get_bd_pins CryptV_0/a0]
connect_bd_net [get_bd_pins axi_gpio_a1/gpio_io_o] [get_bd_pins CryptV_0/a1]
connect_bd_net [get_bd_pins axi_gpio_a2/gpio_io_o] [get_bd_pins CryptV_0/a2]
connect_bd_net [get_bd_pins axi_gpio_a3/gpio_io_o] [get_bd_pins CryptV_0/a3]
connect_bd_net [get_bd_pins axi_gpio_b0/gpio_io_o] [get_bd_pins CryptV_0/b0]
connect_bd_net [get_bd_pins axi_gpio_b1/gpio_io_o] [get_bd_pins CryptV_0/b1]
connect_bd_net [get_bd_pins axi_gpio_b2/gpio_io_o] [get_bd_pins CryptV_0/b2]
connect_bd_net [get_bd_pins axi_gpio_b3/gpio_io_o] [get_bd_pins CryptV_0/b3]
connect_bd_net [get_bd_pins axi_gpio_c0/gpio_io_o] [get_bd_pins CryptV_0/c0]
connect_bd_net [get_bd_pins axi_gpio_c1/gpio_io_o] [get_bd_pins CryptV_0/c1]
connect_bd_net [get_bd_pins axi_gpio_c2/gpio_io_o] [get_bd_pins CryptV_0/c2]
connect_bd_net [get_bd_pins axi_gpio_c3/gpio_io_o] [get_bd_pins CryptV_0/c3]
connect_bd_net [get_bd_pins axi_gpio_d0/gpio_io_o] [get_bd_pins CryptV_0/d0]
connect_bd_net [get_bd_pins axi_gpio_d1/gpio_io_o] [get_bd_pins CryptV_0/d1]
connect_bd_net [get_bd_pins axi_gpio_d2/gpio_io_o] [get_bd_pins CryptV_0/d2]
connect_bd_net [get_bd_pins axi_gpio_d3/gpio_io_o] [get_bd_pins CryptV_0/d3]
connect_bd_net [get_bd_pins processing_system7_0/FCLK_CLK0] \
  [get_bd_pins processing_system7_0/M_AXI_GP0_ACLK] [get_bd_pins ps7_0_axi_periph/S00_ACLK] \
  [get_bd_pins rst_ps7_0_100M/slowest_sync_clk] [get_bd_pins axi_gpio_a0/s_axi_aclk] [get_bd_pins ps7_0_axi_periph/M00_ACLK] \
  [get_bd_pins ps7_0_axi_periph/ACLK] [get_bd_pins ps7_0_axi_periph/M01_ACLK] [get_bd_pins ps7_0_axi_periph/M02_ACLK] \
  [get_bd_pins ps7_0_axi_periph/M03_ACLK] [get_bd_pins ps7_0_axi_periph/M06_ACLK] [get_bd_pins ps7_0_axi_periph/M07_ACLK] \
  [get_bd_pins ps7_0_axi_periph/M08_ACLK] [get_bd_pins ps7_0_axi_periph/M09_ACLK] [get_bd_pins axi_gpio_key/s_axi_aclk] \
  [get_bd_pins ps7_0_axi_periph/M04_ACLK] [get_bd_pins axi_gpio_mode/s_axi_aclk] [get_bd_pins ps7_0_axi_periph/M05_ACLK] \
  [get_bd_pins axi_gpio_q0/s_axi_aclk] [get_bd_pins ps7_0_axi_periph/M10_ACLK] [get_bd_pins ps7_0_axi_periph/M11_ACLK] \
  [get_bd_pins ps7_0_axi_periph/M12_ACLK] [get_bd_pins ps7_0_axi_periph/M13_ACLK] [get_bd_pins ps7_0_axi_periph/M14_ACLK] \
  [get_bd_pins ps7_0_axi_periph/M15_ACLK] [get_bd_pins ps7_0_axi_periph/M16_ACLK] [get_bd_pins ps7_0_axi_periph/M17_ACLK] \
  [get_bd_pins axi_gpio_w0/s_axi_aclk] [get_bd_pins ps7_0_axi_periph/M18_ACLK] [get_bd_pins ps7_0_axi_periph/M19_ACLK] \
  [get_bd_pins ps7_0_axi_periph/M20_ACLK] [get_bd_pins ps7_0_axi_periph/M21_ACLK] [get_bd_pins ps7_0_axi_periph/M22_ACLK] \
  [get_bd_pins ps7_0_axi_periph/M23_ACLK] [get_bd_pins ps7_0_axi_periph/M24_ACLK] [get_bd_pins ps7_0_axi_periph/M25_ACLK] \
  [get_bd_pins axi_gpio_a1/s_axi_aclk] [get_bd_pins axi_gpio_a2/s_axi_aclk] [get_bd_pins axi_gpio_a3/s_axi_aclk] \
  [get_bd_pins axi_gpio_b0/s_axi_aclk] [get_bd_pins axi_gpio_b1/s_axi_aclk] [get_bd_pins axi_gpio_b2/s_axi_aclk] \
  [get_bd_pins axi_gpio_b3/s_axi_aclk] [get_bd_pins axi_gpio_c0/s_axi_aclk] [get_bd_pins axi_gpio_c1/s_axi_aclk] \
  [get_bd_pins axi_gpio_c2/s_axi_aclk] [get_bd_pins axi_gpio_c3/s_axi_aclk] [get_bd_pins axi_gpio_d0/s_axi_aclk] \
  [get_bd_pins axi_gpio_d1/s_axi_aclk] [get_bd_pins axi_gpio_d2/s_axi_aclk] [get_bd_pins axi_gpio_d3/s_axi_aclk] \
  [get_bd_pins axi_gpio_q1/s_axi_aclk] [get_bd_pins axi_gpio_q2/s_axi_aclk] [get_bd_pins axi_gpio_q3/s_axi_aclk] \
  [get_bd_pins axi_gpio_q4/s_axi_aclk] [get_bd_pins axi_gpio_q5/s_axi_aclk] [get_bd_pins axi_gpio_q6/s_axi_aclk] \
  [get_bd_pins axi_gpio_q7/s_axi_aclk] [get_bd_pins ps7_0_axi_periph/M26_ACLK] [get_bd_pins axi_gpio_q8/s_axi_aclk] \
  [get_bd_pins ps7_0_axi_periph/M27_ACLK] [get_bd_pins axi_gpio_q9/s_axi_aclk] [get_bd_pins ps7_0_axi_periph/M28_ACLK] \
  [get_bd_pins axi_gpio_q10/s_axi_aclk] [get_bd_pins ps7_0_axi_periph/M29_ACLK] [get_bd_pins axi_gpio_q11/s_axi_aclk] \
  [get_bd_pins ps7_0_axi_periph/M30_ACLK] [get_bd_pins axi_gpio_q12/s_axi_aclk] [get_bd_pins ps7_0_axi_periph/M31_ACLK] \
  [get_bd_pins axi_gpio_q13/s_axi_aclk] [get_bd_pins ps7_0_axi_periph/M32_ACLK] [get_bd_pins axi_gpio_q14/s_axi_aclk] \
  [get_bd_pins ps7_0_axi_periph/M33_ACLK] [get_bd_pins axi_gpio_q15/s_axi_aclk] [get_bd_pins ps7_0_axi_periph/M34_ACLK] \
  [get_bd_pins axi_gpio_w1/s_axi_aclk] [get_bd_pins ps7_0_axi_periph/M35_ACLK] [get_bd_pins axi_gpio_w2/s_axi_aclk] \
  [get_bd_pins ps7_0_axi_periph/M36_ACLK] [get_bd_pins axi_gpio_w3/s_axi_aclk] [get_bd_pins ps7_0_axi_periph/M37_ACLK] \
  [get_bd_pins axi_gpio_w4/s_axi_aclk] [get_bd_pins ps7_0_axi_periph/M38_ACLK] [get_bd_pins axi_gpio_w5/s_axi_aclk] \
  [get_bd_pins ps7_0_axi_periph/M39_ACLK] [get_bd_pins axi_gpio_w6/s_axi_aclk] [get_bd_pins ps7_0_axi_periph/M40_ACLK] \
  [get_bd_pins axi_gpio_w7/s_axi_aclk] [get_bd_pins ps7_0_axi_periph/M41_ACLK] [get_bd_pins axi_gpio_w8/s_axi_aclk] \
  [get_bd_pins ps7_0_axi_periph/M42_ACLK] [get_bd_pins axi_gpio_w9/s_axi_aclk] [get_bd_pins ps7_0_axi_periph/M43_ACLK] \
  [get_bd_pins axi_gpio_w10/s_axi_aclk] [get_bd_pins ps7_0_axi_periph/M44_ACLK] [get_bd_pins axi_gpio_w11/s_axi_aclk] \
  [get_bd_pins ps7_0_axi_periph/M45_ACLK] [get_bd_pins axi_gpio_w12/s_axi_aclk] [get_bd_pins ps7_0_axi_periph/M46_ACLK] \
  [get_bd_pins axi_gpio_w13/s_axi_aclk] [get_bd_pins ps7_0_axi_periph/M47_ACLK] [get_bd_pins axi_gpio_w14/s_axi_aclk] \
  [get_bd_pins ps7_0_axi_periph/M48_ACLK] [get_bd_pins axi_gpio_w15/s_axi_aclk] [get_bd_pins ps7_0_axi_periph/M49_ACLK]
connect_bd_net [get_bd_pins processing_system7_0/FCLK_RESET0_N] [get_bd_pins rst_ps7_0_100M/ext_reset_in]
connect_bd_net [get_bd_pins rst_ps7_0_100M/peripheral_aresetn] \
  [get_bd_pins ps7_0_axi_periph/S00_ARESETN] [get_bd_pins axi_gpio_a0/s_axi_aresetn] \
  [get_bd_pins ps7_0_axi_periph/M00_ARESETN] [get_bd_pins ps7_0_axi_periph/ARESETN] \
  [get_bd_pins ps7_0_axi_periph/M01_ARESETN] [get_bd_pins ps7_0_axi_periph/M02_ARESETN] \
  [get_bd_pins ps7_0_axi_periph/M03_ARESETN] [get_bd_pins ps7_0_axi_periph/M06_ARESETN] \
  [get_bd_pins ps7_0_axi_periph/M07_ARESETN] [get_bd_pins ps7_0_axi_periph/M08_ARESETN] \
  [get_bd_pins ps7_0_axi_periph/M09_ARESETN] [get_bd_pins axi_gpio_key/s_axi_aresetn] \
  [get_bd_pins ps7_0_axi_periph/M04_ARESETN] [get_bd_pins axi_gpio_mode/s_axi_aresetn] \
  [get_bd_pins ps7_0_axi_periph/M05_ARESETN] [get_bd_pins axi_gpio_q0/s_axi_aresetn] \
  [get_bd_pins ps7_0_axi_periph/M10_ARESETN] [get_bd_pins ps7_0_axi_periph/M11_ARESETN] \
  [get_bd_pins ps7_0_axi_periph/M12_ARESETN] [get_bd_pins ps7_0_axi_periph/M13_ARESETN] \
  [get_bd_pins ps7_0_axi_periph/M14_ARESETN] [get_bd_pins ps7_0_axi_periph/M15_ARESETN] \
  [get_bd_pins ps7_0_axi_periph/M16_ARESETN] [get_bd_pins ps7_0_axi_periph/M17_ARESETN] \
  [get_bd_pins axi_gpio_w0/s_axi_aresetn] [get_bd_pins ps7_0_axi_periph/M18_ARESETN] \
  [get_bd_pins ps7_0_axi_periph/M19_ARESETN] [get_bd_pins ps7_0_axi_periph/M20_ARESETN] \
  [get_bd_pins ps7_0_axi_periph/M21_ARESETN] [get_bd_pins ps7_0_axi_periph/M22_ARESETN] \
  [get_bd_pins ps7_0_axi_periph/M23_ARESETN] [get_bd_pins ps7_0_axi_periph/M24_ARESETN] \
  [get_bd_pins ps7_0_axi_periph/M25_ARESETN] [get_bd_pins axi_gpio_a1/s_axi_aresetn] [get_bd_pins axi_gpio_a2/s_axi_aresetn] \
  [get_bd_pins axi_gpio_a3/s_axi_aresetn] [get_bd_pins axi_gpio_b0/s_axi_aresetn] [get_bd_pins axi_gpio_b1/s_axi_aresetn] \
  [get_bd_pins axi_gpio_b2/s_axi_aresetn] [get_bd_pins axi_gpio_b3/s_axi_aresetn] [get_bd_pins axi_gpio_c0/s_axi_aresetn] \
  [get_bd_pins axi_gpio_c1/s_axi_aresetn] [get_bd_pins axi_gpio_c2/s_axi_aresetn] [get_bd_pins axi_gpio_c3/s_axi_aresetn] \
  [get_bd_pins axi_gpio_d0/s_axi_aresetn] [get_bd_pins axi_gpio_d1/s_axi_aresetn] [get_bd_pins axi_gpio_d2/s_axi_aresetn] \
  [get_bd_pins axi_gpio_d3/s_axi_aresetn] [get_bd_pins axi_gpio_q1/s_axi_aresetn] [get_bd_pins axi_gpio_q2/s_axi_aresetn] \
  [get_bd_pins axi_gpio_q3/s_axi_aresetn] [get_bd_pins axi_gpio_q4/s_axi_aresetn] [get_bd_pins axi_gpio_q5/s_axi_aresetn] \
  [get_bd_pins axi_gpio_q6/s_axi_aresetn] [get_bd_pins axi_gpio_q7/s_axi_aresetn] [get_bd_pins ps7_0_axi_periph/M26_ARESETN] \
  [get_bd_pins axi_gpio_q8/s_axi_aresetn] [get_bd_pins ps7_0_axi_periph/M27_ARESETN] [get_bd_pins axi_gpio_q9/s_axi_aresetn] \
  [get_bd_pins ps7_0_axi_periph/M28_ARESETN] [get_bd_pins axi_gpio_q10/s_axi_aresetn] \
  [get_bd_pins ps7_0_axi_periph/M29_ARESETN] [get_bd_pins axi_gpio_q11/s_axi_aresetn] \
  [get_bd_pins ps7_0_axi_periph/M30_ARESETN] [get_bd_pins axi_gpio_q12/s_axi_aresetn] \
  [get_bd_pins ps7_0_axi_periph/M31_ARESETN] [get_bd_pins axi_gpio_q13/s_axi_aresetn] \
  [get_bd_pins ps7_0_axi_periph/M32_ARESETN] [get_bd_pins axi_gpio_q14/s_axi_aresetn] \
  [get_bd_pins ps7_0_axi_periph/M33_ARESETN] [get_bd_pins axi_gpio_q15/s_axi_aresetn] \
  [get_bd_pins ps7_0_axi_periph/M34_ARESETN] [get_bd_pins axi_gpio_w1/s_axi_aresetn] \
  [get_bd_pins ps7_0_axi_periph/M35_ARESETN] [get_bd_pins axi_gpio_w2/s_axi_aresetn] \
  [get_bd_pins ps7_0_axi_periph/M36_ARESETN] [get_bd_pins axi_gpio_w3/s_axi_aresetn] \
  [get_bd_pins ps7_0_axi_periph/M37_ARESETN] [get_bd_pins axi_gpio_w4/s_axi_aresetn] \
  [get_bd_pins ps7_0_axi_periph/M38_ARESETN] [get_bd_pins axi_gpio_w5/s_axi_aresetn] \
  [get_bd_pins ps7_0_axi_periph/M39_ARESETN] [get_bd_pins axi_gpio_w6/s_axi_aresetn] \
  [get_bd_pins ps7_0_axi_periph/M40_ARESETN] [get_bd_pins axi_gpio_w7/s_axi_aresetn] \
  [get_bd_pins ps7_0_axi_periph/M41_ARESETN] [get_bd_pins axi_gpio_w8/s_axi_aresetn] \
  [get_bd_pins ps7_0_axi_periph/M42_ARESETN] [get_bd_pins axi_gpio_w9/s_axi_aresetn] \
  [get_bd_pins ps7_0_axi_periph/M43_ARESETN] [get_bd_pins axi_gpio_w10/s_axi_aresetn] \
  [get_bd_pins ps7_0_axi_periph/M44_ARESETN] [get_bd_pins axi_gpio_w11/s_axi_aresetn] \
  [get_bd_pins ps7_0_axi_periph/M45_ARESETN] [get_bd_pins axi_gpio_w12/s_axi_aresetn] \
  [get_bd_pins ps7_0_axi_periph/M46_ARESETN] [get_bd_pins axi_gpio_w13/s_axi_aresetn] \
  [get_bd_pins ps7_0_axi_periph/M47_ARESETN] [get_bd_pins axi_gpio_w14/s_axi_aresetn] \
  [get_bd_pins ps7_0_axi_periph/M48_ARESETN] [get_bd_pins axi_gpio_w15/s_axi_aresetn] \
  [get_bd_pins ps7_0_axi_periph/M49_ARESETN]

# ---- address map ----
assign_bd_address -offset 0x41200000 -range 64K -target_address_space [get_bd_addr_spaces processing_system7_0/Data] [get_bd_addr_segs axi_gpio_a0/S_AXI/Reg]
assign_bd_address -offset 0x41210000 -range 64K -target_address_space [get_bd_addr_spaces processing_system7_0/Data] [get_bd_addr_segs axi_gpio_a1/S_AXI/Reg]
assign_bd_address -offset 0x41220000 -range 64K -target_address_space [get_bd_addr_spaces processing_system7_0/Data] [get_bd_addr_segs axi_gpio_a2/S_AXI/Reg]
assign_bd_address -offset 0x41230000 -range 64K -target_address_space [get_bd_addr_spaces processing_system7_0/Data] [get_bd_addr_segs axi_gpio_a3/S_AXI/Reg]
assign_bd_address -offset 0x41240000 -range 64K -target_address_space [get_bd_addr_spaces processing_system7_0/Data] [get_bd_addr_segs axi_gpio_key/S_AXI/Reg]
assign_bd_address -offset 0x41250000 -range 64K -target_address_space [get_bd_addr_spaces processing_system7_0/Data] [get_bd_addr_segs axi_gpio_mode/S_AXI/Reg]
assign_bd_address -offset 0x41260000 -range 64K -target_address_space [get_bd_addr_spaces processing_system7_0/Data] [get_bd_addr_segs axi_gpio_q0/S_AXI/Reg]
assign_bd_address -offset 0x41270000 -range 64K -target_address_space [get_bd_addr_spaces processing_system7_0/Data] [get_bd_addr_segs axi_gpio_b0/S_AXI/Reg]
assign_bd_address -offset 0x41280000 -range 64K -target_address_space [get_bd_addr_spaces processing_system7_0/Data] [get_bd_addr_segs axi_gpio_b1/S_AXI/Reg]
assign_bd_address -offset 0x41290000 -range 64K -target_address_space [get_bd_addr_spaces processing_system7_0/Data] [get_bd_addr_segs axi_gpio_b2/S_AXI/Reg]
assign_bd_address -offset 0x412A0000 -range 64K -target_address_space [get_bd_addr_spaces processing_system7_0/Data] [get_bd_addr_segs axi_gpio_w0/S_AXI/Reg]
assign_bd_address -offset 0x412B0000 -range 64K -target_address_space [get_bd_addr_spaces processing_system7_0/Data] [get_bd_addr_segs axi_gpio_b3/S_AXI/Reg]
assign_bd_address -offset 0x412C0000 -range 64K -target_address_space [get_bd_addr_spaces processing_system7_0/Data] [get_bd_addr_segs axi_gpio_c0/S_AXI/Reg]
assign_bd_address -offset 0x412D0000 -range 64K -target_address_space [get_bd_addr_spaces processing_system7_0/Data] [get_bd_addr_segs axi_gpio_c1/S_AXI/Reg]
assign_bd_address -offset 0x412E0000 -range 64K -target_address_space [get_bd_addr_spaces processing_system7_0/Data] [get_bd_addr_segs axi_gpio_c2/S_AXI/Reg]
assign_bd_address -offset 0x412F0000 -range 64K -target_address_space [get_bd_addr_spaces processing_system7_0/Data] [get_bd_addr_segs axi_gpio_c3/S_AXI/Reg]
assign_bd_address -offset 0x41300000 -range 64K -target_address_space [get_bd_addr_spaces processing_system7_0/Data] [get_bd_addr_segs axi_gpio_d0/S_AXI/Reg]
assign_bd_address -offset 0x41310000 -range 64K -target_address_space [get_bd_addr_spaces processing_system7_0/Data] [get_bd_addr_segs axi_gpio_d1/S_AXI/Reg]
assign_bd_address -offset 0x41320000 -range 64K -target_address_space [get_bd_addr_spaces processing_system7_0/Data] [get_bd_addr_segs axi_gpio_d2/S_AXI/Reg]
assign_bd_address -offset 0x41330000 -range 64K -target_address_space [get_bd_addr_spaces processing_system7_0/Data] [get_bd_addr_segs axi_gpio_d3/S_AXI/Reg]
assign_bd_address -offset 0x41340000 -range 64K -target_address_space [get_bd_addr_spaces processing_system7_0/Data] [get_bd_addr_segs axi_gpio_q1/S_AXI/Reg]
assign_bd_address -offset 0x41350000 -range 64K -target_address_space [get_bd_addr_spaces processing_system7_0/Data] [get_bd_addr_segs axi_gpio_q2/S_AXI/Reg]
assign_bd_address -offset 0x41360000 -range 64K -target_address_space [get_bd_addr_spaces processing_system7_0/Data] [get_bd_addr_segs axi_gpio_q3/S_AXI/Reg]
assign_bd_address -offset 0x41370000 -range 64K -target_address_space [get_bd_addr_spaces processing_system7_0/Data] [get_bd_addr_segs axi_gpio_q4/S_AXI/Reg]
assign_bd_address -offset 0x41380000 -range 64K -target_address_space [get_bd_addr_spaces processing_system7_0/Data] [get_bd_addr_segs axi_gpio_q5/S_AXI/Reg]
assign_bd_address -offset 0x41390000 -range 64K -target_address_space [get_bd_addr_spaces processing_system7_0/Data] [get_bd_addr_segs axi_gpio_q6/S_AXI/Reg]
assign_bd_address -offset 0x413A0000 -range 64K -target_address_space [get_bd_addr_spaces processing_system7_0/Data] [get_bd_addr_segs axi_gpio_q7/S_AXI/Reg]
assign_bd_address -offset 0x413B0000 -range 64K -target_address_space [get_bd_addr_spaces processing_system7_0/Data] [get_bd_addr_segs axi_gpio_q8/S_AXI/Reg]
assign_bd_address -offset 0x413C0000 -range 64K -target_address_space [get_bd_addr_spaces processing_system7_0/Data] [get_bd_addr_segs axi_gpio_q9/S_AXI/Reg]
assign_bd_address -offset 0x413D0000 -range 64K -target_address_space [get_bd_addr_spaces processing_system7_0/Data] [get_bd_addr_segs axi_gpio_q10/S_AXI/Reg]
assign_bd_address -offset 0x413E0000 -range 64K -target_address_space [get_bd_addr_spaces processing_system7_0/Data] [get_bd_addr_segs axi_gpio_q11/S_AXI/Reg]
assign_bd_address -offset 0x413F0000 -range 64K -target_address_space [get_bd_addr_spaces processing_system7_0/Data] [get_bd_addr_segs axi_gpio_q12/S_AXI/Reg]
assign_bd_address -offset 0x41400000 -range 64K -target_address_space [get_bd_addr_spaces processing_system7_0/Data] [get_bd_addr_segs axi_gpio_q13/S_AXI/Reg]
assign_bd_address -offset 0x41410000 -range 64K -target_address_space [get_bd_addr_spaces processing_system7_0/Data] [get_bd_addr_segs axi_gpio_q14/S_AXI/Reg]
assign_bd_address -offset 0x41420000 -range 64K -target_address_space [get_bd_addr_spaces processing_system7_0/Data] [get_bd_addr_segs axi_gpio_q15/S_AXI/Reg]
assign_bd_address -offset 0x41430000 -range 64K -target_address_space [get_bd_addr_spaces processing_system7_0/Data] [get_bd_addr_segs axi_gpio_w1/S_AXI/Reg]
assign_bd_address -offset 0x41440000 -range 64K -target_address_space [get_bd_addr_spaces processing_system7_0/Data] [get_bd_addr_segs axi_gpio_w2/S_AXI/Reg]
assign_bd_address -offset 0x41450000 -range 64K -target_address_space [get_bd_addr_spaces processing_system7_0/Data] [get_bd_addr_segs axi_gpio_w3/S_AXI/Reg]
assign_bd_address -offset 0x41460000 -range 64K -target_address_space [get_bd_addr_spaces processing_system7_0/Data] [get_bd_addr_segs axi_gpio_w4/S_AXI/Reg]
assign_bd_address -offset 0x41470000 -range 64K -target_address_space [get_bd_addr_spaces processing_system7_0/Data] [get_bd_addr_segs axi_gpio_w5/S_AXI/Reg]
assign_bd_address -offset 0x41480000 -range 64K -target_address_space [get_bd_addr_spaces processing_system7_0/Data] [get_bd_addr_segs axi_gpio_w6/S_AXI/Reg]
assign_bd_address -offset 0x41490000 -range 64K -target_address_space [get_bd_addr_spaces processing_system7_0/Data] [get_bd_addr_segs axi_gpio_w7/S_AXI/Reg]
assign_bd_address -offset 0x414A0000 -range 64K -target_address_space [get_bd_addr_spaces processing_system7_0/Data] [get_bd_addr_segs axi_gpio_w8/S_AXI/Reg]
assign_bd_address -offset 0x414B0000 -range 64K -target_address_space [get_bd_addr_spaces processing_system7_0/Data] [get_bd_addr_segs axi_gpio_w9/S_AXI/Reg]
assign_bd_address -offset 0x414C0000 -range 64K -target_address_space [get_bd_addr_spaces processing_system7_0/Data] [get_bd_addr_segs axi_gpio_w10/S_AXI/Reg]
assign_bd_address -offset 0x414D0000 -range 64K -target_address_space [get_bd_addr_spaces processing_system7_0/Data] [get_bd_addr_segs axi_gpio_w11/S_AXI/Reg]
assign_bd_address -offset 0x414E0000 -range 64K -target_address_space [get_bd_addr_spaces processing_system7_0/Data] [get_bd_addr_segs axi_gpio_w12/S_AXI/Reg]
assign_bd_address -offset 0x414F0000 -range 64K -target_address_space [get_bd_addr_spaces processing_system7_0/Data] [get_bd_addr_segs axi_gpio_w13/S_AXI/Reg]
assign_bd_address -offset 0x41500000 -range 64K -target_address_space [get_bd_addr_spaces processing_system7_0/Data] [get_bd_addr_segs axi_gpio_w14/S_AXI/Reg]
assign_bd_address -offset 0x41510000 -range 64K -target_address_space [get_bd_addr_spaces processing_system7_0/Data] [get_bd_addr_segs axi_gpio_w15/S_AXI/Reg]

validate_bd_design
save_bd_design
